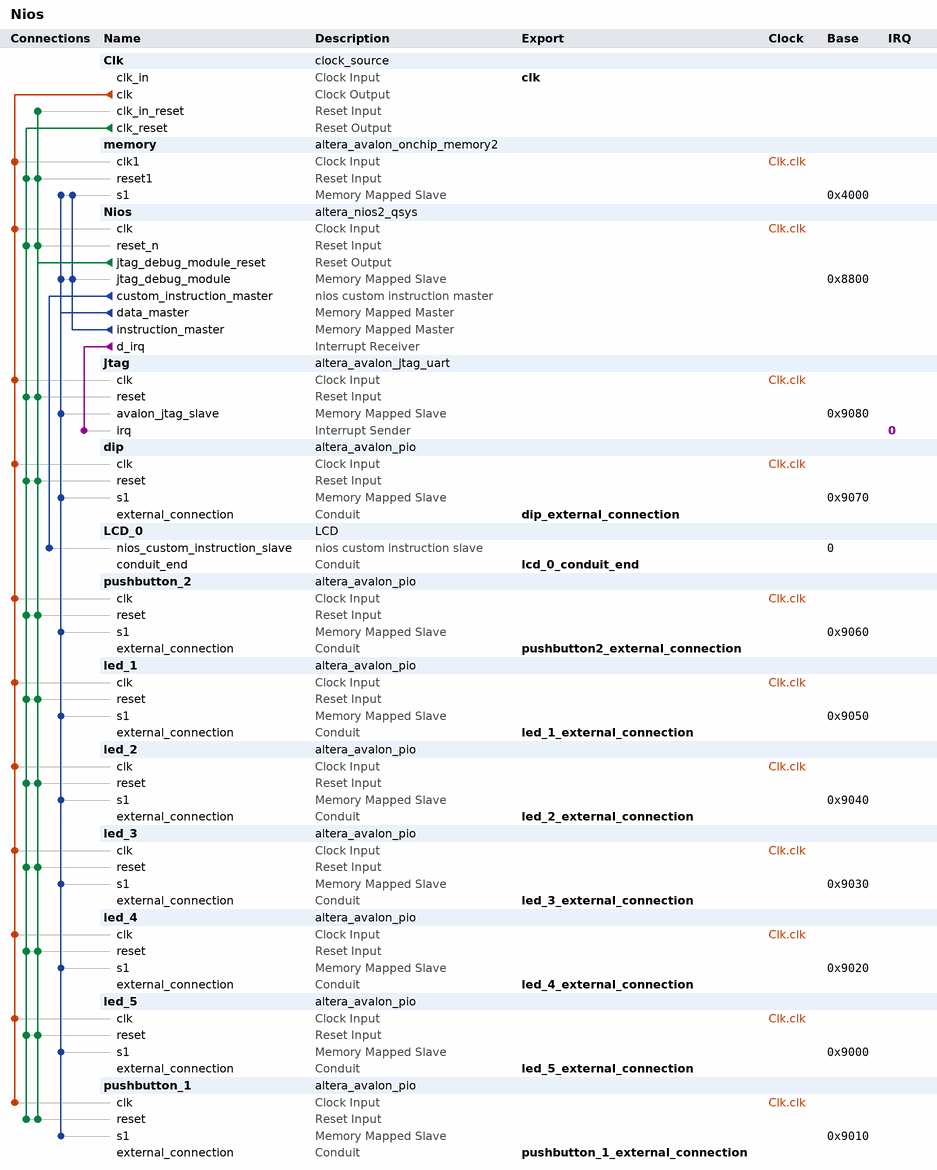
[diagram p0: system contents]
# Platform Designer (Qsys) system Nios, Cyclone IV E EP4CE6E22C8
# Parameters at their usual value, and those the tool derives, are not listed.
package require -exact qsys 13.1
create_system Nios
set_project_property DEVICE_FAMILY {Cyclone IV E}
set_project_property DEVICE EP4CE6E22C8

add_instance Clk clock_source 13.1
set_instance_parameter_value Clk clockFrequency 50000000

add_instance memory altera_avalon_onchip_memory2 13.1
set_instance_parameter_value memory dataWidth 32
set_instance_parameter_value memory dualPort false
set_instance_parameter_value memory initMemContent true
set_instance_parameter_value memory initializationFileName onchip_mem.hex
set_instance_parameter_value memory memorySize 16384

add_instance Nios altera_nios2_qsys 13.1
set_instance_parameter_value Nios muldiv_divider true
set_instance_parameter_value Nios resetSlave memory.s1
set_instance_parameter_value Nios mmu_TLBMissExcSlave None
set_instance_parameter_value Nios exceptionSlave memory.s1
set_instance_parameter_value Nios breakSlave Nios.jtag_debug_module
set_instance_parameter_value Nios muldiv_multiplierType LogicElementsFast
set_instance_parameter_value Nios impl Tiny
set_instance_parameter_value Nios icache_size 4096

add_instance Jtag altera_avalon_jtag_uart 13.1
set_instance_parameter_value Jtag simInteractiveOptions NO_INTERACTIVE_WINDOWS

add_instance dip altera_avalon_pio 13.1
set_instance_parameter_value dip direction Input
set_instance_parameter_value dip width 4

add_instance LCD_0 LCD 1.0

add_instance pushbutton_2 altera_avalon_pio 13.1
set_instance_parameter_value pushbutton_2 captureEdge true
set_instance_parameter_value pushbutton_2 direction Input
set_instance_parameter_value pushbutton_2 edgeType FALLING
set_instance_parameter_value pushbutton_2 width 1

add_instance led_1 altera_avalon_pio 13.1
set_instance_parameter_value led_1 direction Output
set_instance_parameter_value led_1 width 1

add_instance led_2 altera_avalon_pio 13.1
set_instance_parameter_value led_2 direction Output
set_instance_parameter_value led_2 width 1

add_instance led_3 altera_avalon_pio 13.1
set_instance_parameter_value led_3 direction Output
set_instance_parameter_value led_3 width 1

add_instance led_4 altera_avalon_pio 13.1
set_instance_parameter_value led_4 direction Output
set_instance_parameter_value led_4 width 1

add_instance led_5 altera_avalon_pio 13.1
set_instance_parameter_value led_5 direction Output
set_instance_parameter_value led_5 width 1

add_instance pushbutton_1 altera_avalon_pio 13.1
set_instance_parameter_value pushbutton_1 captureEdge true
set_instance_parameter_value pushbutton_1 direction Input
set_instance_parameter_value pushbutton_1 edgeType FALLING
set_instance_parameter_value pushbutton_1 width 1

# connections
add_connection Clk.clk dip.clk clock
add_connection Clk.clk Jtag.clk clock
add_connection Clk.clk led_1.clk clock
add_connection Clk.clk led_2.clk clock
add_connection Clk.clk led_3.clk clock
add_connection Clk.clk led_4.clk clock
add_connection Clk.clk led_5.clk clock
add_connection Clk.clk memory.clk1 clock
add_connection Clk.clk Nios.clk clock
add_connection Clk.clk pushbutton_1.clk clock
add_connection Clk.clk pushbutton_2.clk clock
add_connection Clk.clk_reset dip.reset reset
add_connection Clk.clk_reset Jtag.reset reset
add_connection Clk.clk_reset led_1.reset reset
add_connection Clk.clk_reset led_2.reset reset
add_connection Clk.clk_reset led_3.reset reset
add_connection Clk.clk_reset led_4.reset reset
add_connection Clk.clk_reset led_5.reset reset
add_connection Clk.clk_reset memory.reset1 reset
add_connection Clk.clk_reset Nios.reset_n reset
add_connection Clk.clk_reset pushbutton_1.reset reset
add_connection Clk.clk_reset pushbutton_2.reset reset
add_connection Nios.jtag_debug_module_reset Clk.clk_in_reset reset
add_connection Nios.jtag_debug_module_reset dip.reset reset
add_connection Nios.jtag_debug_module_reset Jtag.reset reset
add_connection Nios.jtag_debug_module_reset led_1.reset reset
add_connection Nios.jtag_debug_module_reset led_2.reset reset
add_connection Nios.jtag_debug_module_reset led_3.reset reset
add_connection Nios.jtag_debug_module_reset led_4.reset reset
add_connection Nios.jtag_debug_module_reset led_5.reset reset
add_connection Nios.jtag_debug_module_reset memory.reset1 reset
add_connection Nios.jtag_debug_module_reset Nios.reset_n reset
add_connection Nios.jtag_debug_module_reset pushbutton_1.reset reset
add_connection Nios.jtag_debug_module_reset pushbutton_2.reset reset
add_connection Nios.data_master dip.s1 avalon
set_connection_parameter_value Nios.data_master/dip.s1 baseAddress 0x9070
add_connection Nios.data_master Jtag.avalon_jtag_slave avalon
set_connection_parameter_value Nios.data_master/Jtag.avalon_jtag_slave baseAddress 0x9080
add_connection Nios.data_master led_1.s1 avalon
set_connection_parameter_value Nios.data_master/led_1.s1 baseAddress 0x9050
add_connection Nios.data_master led_2.s1 avalon
set_connection_parameter_value Nios.data_master/led_2.s1 baseAddress 0x9040
add_connection Nios.data_master led_3.s1 avalon
set_connection_parameter_value Nios.data_master/led_3.s1 baseAddress 0x9030
add_connection Nios.data_master led_4.s1 avalon
set_connection_parameter_value Nios.data_master/led_4.s1 baseAddress 0x9020
add_connection Nios.data_master led_5.s1 avalon
set_connection_parameter_value Nios.data_master/led_5.s1 baseAddress 0x9000
add_connection Nios.data_master memory.s1 avalon
set_connection_parameter_value Nios.data_master/memory.s1 baseAddress 0x4000
add_connection Nios.data_master Nios.jtag_debug_module avalon
set_connection_parameter_value Nios.data_master/Nios.jtag_debug_module baseAddress 0x8800
add_connection Nios.data_master pushbutton_1.s1 avalon
set_connection_parameter_value Nios.data_master/pushbutton_1.s1 baseAddress 0x9010
add_connection Nios.data_master pushbutton_2.s1 avalon
set_connection_parameter_value Nios.data_master/pushbutton_2.s1 baseAddress 0x9060
add_connection Nios.instruction_master memory.s1 avalon
set_connection_parameter_value Nios.instruction_master/memory.s1 baseAddress 0x4000
add_connection Nios.instruction_master Nios.jtag_debug_module avalon
set_connection_parameter_value Nios.instruction_master/Nios.jtag_debug_module baseAddress 0x8800
add_connection Nios.d_irq Jtag.irq interrupt
set_connection_parameter_value Nios.d_irq/Jtag.irq irqNumber 0
add_connection Nios.custom_instruction_master LCD_0.nios_custom_instruction_slave nios_custom_instruction
set_connection_parameter_value Nios.custom_instruction_master/LCD_0.nios_custom_instruction_slave CIName lcd_0
set_connection_parameter_value Nios.custom_instruction_master/LCD_0.nios_custom_instruction_slave baseAddress 0

# exported interfaces
add_interface clk clock sink
set_interface_property clk EXPORT_OF Clk.clk_in
add_interface dip_external_connection conduit end
set_interface_property dip_external_connection EXPORT_OF dip.external_connection
add_interface lcd_0_conduit_end conduit end
set_interface_property lcd_0_conduit_end EXPORT_OF LCD_0.conduit_end
add_interface pushbutton2_external_connection conduit end
set_interface_property pushbutton2_external_connection EXPORT_OF pushbutton_2.external_connection
add_interface led_1_external_connection conduit end
set_interface_property led_1_external_connection EXPORT_OF led_1.external_connection
add_interface led_2_external_connection conduit end
set_interface_property led_2_external_connection EXPORT_OF led_2.external_connection
add_interface led_3_external_connection conduit end
set_interface_property led_3_external_connection EXPORT_OF led_3.external_connection
add_interface led_4_external_connection conduit end
set_interface_property led_4_external_connection EXPORT_OF led_4.external_connection
add_interface led_5_external_connection conduit end
set_interface_property led_5_external_connection EXPORT_OF led_5.external_connection
add_interface pushbutton_1_external_connection conduit end
set_interface_property pushbutton_1_external_connection EXPORT_OF pushbutton_1.external_connection

set_interconnect_requirement {$system} qsys_mm.clockCrossingAdapter HANDSHAKE
set_interconnect_requirement {$system} qsys_mm.maxAdditionalLatency 1
set_interconnect_requirement {$system} qsys_mm.insertDefaultSlave false

save_system Nios.qsys
